# Altium schematic sheet LoRa.SchDoc
size A4; SheetNumber: 2; SheetTotal: 7
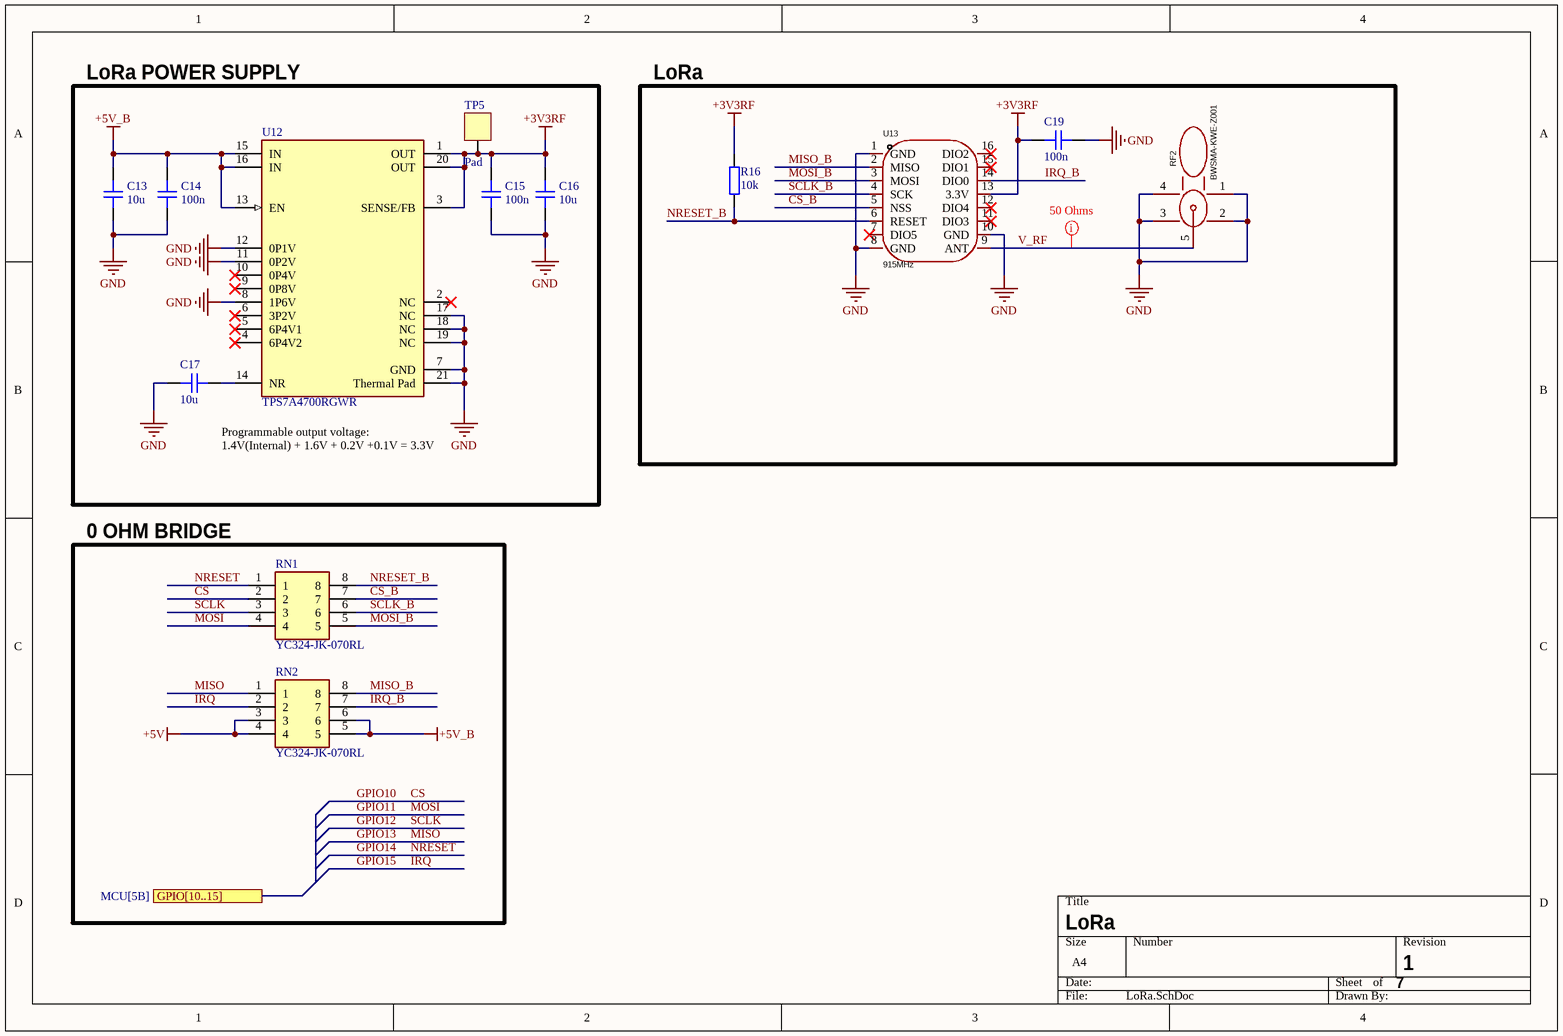
[diagram p0: LoRa.SchDoc]

## Parts
C13  value 10u  [CAP_0402]  (hidden comment: CL05A106MQ5NUNC)
C14  Rating: 100n  [CAP_0402]  (hidden comment: CL05B104KB54PNC)
C15  Rating: 100n  [CAP_0402]  (hidden comment: CL05B104KB54PNC)
C16  value 10u  [CAP_0402]  (hidden comment: CL05A106MQ5NUNC)
C17  value 10u  [CAP_0402]  (hidden comment: CL05A106MQ5NUNC)
C19  Rating: 100n  [CAP_0402]  (hidden comment: CL05B104KB54PNC)
R16  value 10k  [RES_0402]  (hidden comment: 0402WGF1002TCE)
RF2  BWSMA-KWE-Z001  [SMA-TH_BWSMA-KWE-Z001]
RN1  YC324-JK-070RL  [YC324JK07220RL]
RN2  YC324-JK-070RL  [YC324JK07220RL]
TP5  Pad  [PAD_SQ_2MM]  (no BOM)
U12  TPS7A4700RGWR  [FP-RGW0020A-MFG]
U13  915MHz  [LCC-16_L16.0-W16.0-P2.00-TL]

## Blocks framed on the sheet
LoRa POWER SUPPLY: C13-C17 TP5 U12
LoRa: C19 R16 RF2 U13
0 OHM BRIDGE: RN1 RN2

## Ports
GPIO[10..15] (see MCU[5B])

## Nets
+3V3RF: C15.2 C16.2 C19.2 R16.1 TP5.1 U12.1(OUT) U12.3(SENSE/FB) U12.20(OUT) U13.13(3.3V)
+5V: RN2.3 RN2.4
+5V_B: C13.2 C14.2 RN2.5 RN2.6 U12.13(EN) U12.15(IN) U12.16(IN)
GND: C13.1 C14.1 C15.1 C16.1 C17.2 C19.1 RF2.1 RF2.2 RF2.3 RF2.4 U12.7(GND) U12.8(1P6V) U12.11(0P2V) U12.12(0P1V) U12.17(NC) U12.18(NC) U12.19(NC) U12.21(Thermal_Pad) U13.1(GND) U13.8(GND) U13.10(GND)
CS: RN1.2  [also labelled GPIO10]
CS_B: RN1.7 U13.5(NSS)
GPIO11: RN1.4  [also labelled MOSI]
GPIO12: RN1.3  [also labelled SCLK]
GPIO13: RN2.1  [also labelled MISO]
GPIO14: RN1.1  [also labelled NRESET]
GPIO15: RN2.2  [also labelled IRQ]
IRQ_B: RN2.7 U13.14(DIO0)
MISO_B: RN2.8 U13.2(MISO)
MOSI_B: RN1.5 U13.3(MOSI)
NRESET_B: R16.2 RN1.8 U13.6(RESET)
SCLK_B: RN1.6 U13.4(SCK)
V_RF: RF2.5 U13.9(ANT)
NetC17_1: C17.1 U12.14(NR)

Not connected (* = marked no-connect by the designer): U12 2(NC)* 4(6P4V2)* 5(6P4V1)* 6(3P2V)* 9(0P8V)* 10(0P4V)*; U13 7(DIO5)* 11(DIO3)* 12(DIO4)* 15(DIO1)* 16(DIO2)*

## Layout directives
mark named 50 Ohms: V_RF

## Notes on the sheet
- Programmable output voltage:
  1.4V(Internal) + 1.6V + 0.2V +0.1V = 3.3V
- LoRa
- 7
- 1

## Library data of the parts
C13-C17 C19 = CAP_0402: Capacitor SMD 0402; Manufacturer: *; Manufacturer Part Number: *; Distributor Link: *; LCSC: *; Dielectric: *
R16 = RES_0402: Resistor SMD 0402; Manufacturer: *; Manufacturer Part Number: *; Distributor Link: *; LCSC: *
RF2 = BWSMA-KWE-Z001: Manufacturer: BAT WIRELESS(蝙蝠无线); Add into BOM: yes; Connector Type: Board Side; Interface: Inner Bore; Number of Ports: 1; Interface Diameter: 5.3mm; RF Series: SMA; Impedance: 50Ω; Style: Elbow; Symbol: BWSMA-KWE-Z001; Device: BWSMA-KWE-Z001; LCSC Part Name: 内孔 SMA 弯头; Supplier Part: C496551; Manufacturer Part: BWSMA-KWE-Z001; Supplier Footprint: 插件; JLCPCB Part Class: Extended Part; Datasheet: https://item.szlcsc.com/datasheet/BWSMA-KWE-Z001/508500.html; Supplier: LCSC; Convert to PCB: yes; Interface Length/Height: -; Value: -; Operating Temperature Range: -
RN1 RN2 = YC324-JK-070RL: Resistor Network; Manufacturer_Name: YAGEO; Datasheet Link: https://www.yageo.com/upload/media/product/productsearch/datasheet/rchip/PYu-YC_TC_group_51_RoHS_L_9.pdf; Height: 0.7mm; Manufacturer_Part_Number: YC324-JK-070RL; Mouser Part Number: 603-YC324-JK-070RL; Mouser Price/Stock: https://www.mouser.co.uk/ProductDetail/YAGEO/YC324-JK-070RL?qs=k2KEx2DUIRRSvKJyWrVMgA%3D%3D
TP5 = PAD_SQ_2MM: Test Point Square 2mm
U12 = CMP-04917-000027-1: IC REG LINEAR POS ADJ 1A 20VQFN; Manufacturer: Texas Instruments; Output Type: AdjustableProgrammable; Output Voltage: 1.4-20.5V; Nominal Supply Current: 0.58-6.1mA; Max Supply Voltage: 35V; Accuracy Percentage: 1%; Standoff Height: 0mm; Min Supply Voltage: 3V; Max Junction Temp: +125°C; Number Of Outputs: 1; Dropout Voltage: 307mV; RoHS: TRUE; Automotive: No; Temperature Range Low: -40°C; Octopart: https://octopart.com/tps7a4700rgwr-texas+instruments-21221956; Digikey Description: IC REG LINEAR POS ADJ 1A 20VQFN; Temperature: -40°C to +125°C; Device Class L2: Power Management ICs; Manufacturer Part Number: TPS7A4700RGWR; Device Class L1: Integrated Circuits (ICs); Lead Free: Yes; Category: IC; Temperature Range High: +125°C; Package: RGW0020A; Output Current: 1A; ComponentLink2URL: http://www.ti.com/lit/ds/symlink/tps7a47.pdf; ComponentLink2Description: Datasheet; Mouser Description: LDO Voltage Regulators Low Noise,1A,Hi Vltg LDO Reg; Height: 1mm; Device Class L3: Voltage Regulators - Linear
U13 = DL-RFM95-915M: Manufacturer: DreamLNK(骏晔科技); Add into BOM: yes; Output Power: 20dBm; Interface Type: SPI; Modulation System: LoRa；MSK；GFSK；FSK；GMSK；OOK; Voltage - Supply: 1.8V~3.7V; Receive  Current: 10.8mA; Send  Current: 120mA; Sensitivity: -148dBm; Communication Distance: 3km; Symbol: DL-RFM95-915M; Device: DL-RFM95-915M; LCSC Part Name: sx1276 lora模块 无线射频模块 双向收发loraWAN超远离低功耗; Supplier Part: C2844473; Manufacturer Part: DL-RFM95-915M; Supplier Footprint: SMD,16x16mm; JLCPCB Part Class: Extended Part; Datasheet: https://atta.szlcsc.com/upload/public/pdf/source/20240412/4C032EDBEA51F5778F500F593BDA4CE8.pdf; Supplier: LCSC; Convert to PCB: yes; Value: 915MHz; Antenna Type: -; Operating Temperature: -20℃~+70℃